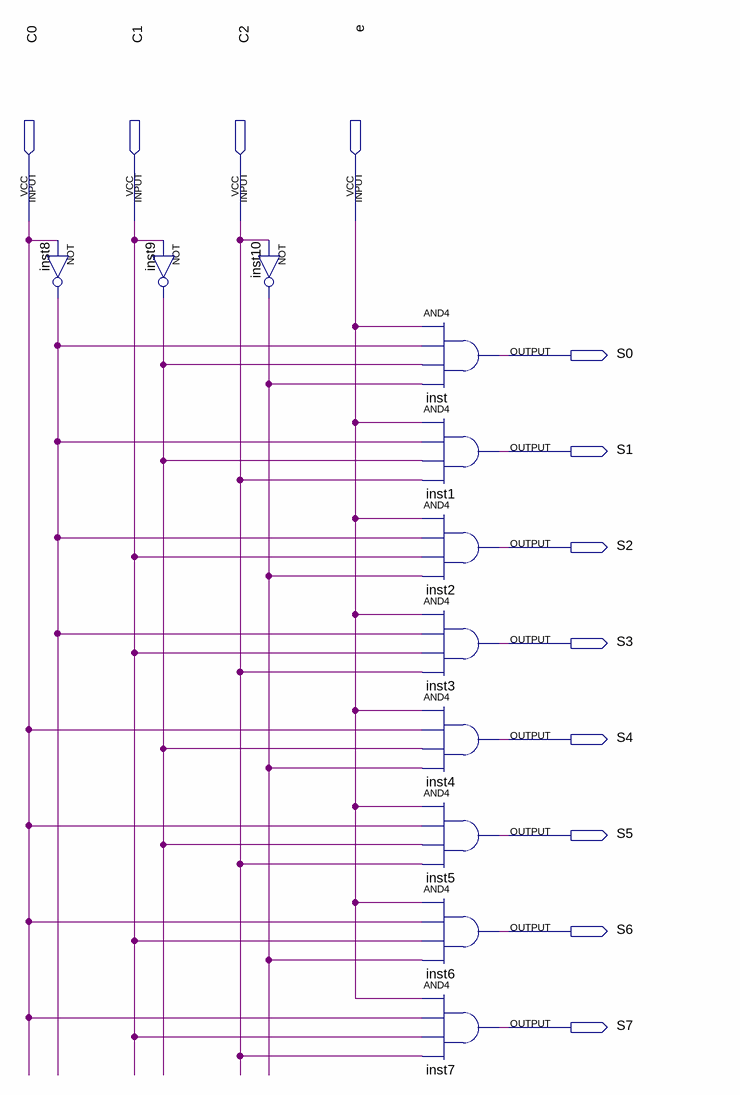
[diagram p0: schematic sheet]
// Quartus schematic demux_decoder_3x8.bdf as structural Verilog: 11 symbols, 12 pins
module demux_decoder_3x8 (
  input  C0,
  input  C1,
  input  C2,
  input  e,
  output S0,
  output S1,
  output S2,
  output S3,
  output S4,
  output S5,
  output S6,
  output S7
);

  wire inst8_out, inst9_out, inst10_out;

  not inst8 (inst8_out, C0);
  not inst9 (inst9_out, C1);
  not inst10 (inst10_out, C2);
  and inst (S0, e, inst8_out, inst9_out, inst10_out);
  and inst1 (S1, e, inst8_out, inst9_out, C2);
  and inst2 (S2, e, inst8_out, C1, inst10_out);
  and inst3 (S3, e, inst8_out, C1, C2);
  and inst4 (S4, e, C0, inst9_out, inst10_out);
  and inst5 (S5, e, C0, inst9_out, C2);
  and inst6 (S6, e, C0, C1, inst10_out);
  and inst7 (S7, e, C0, C1, C2);
endmodule
